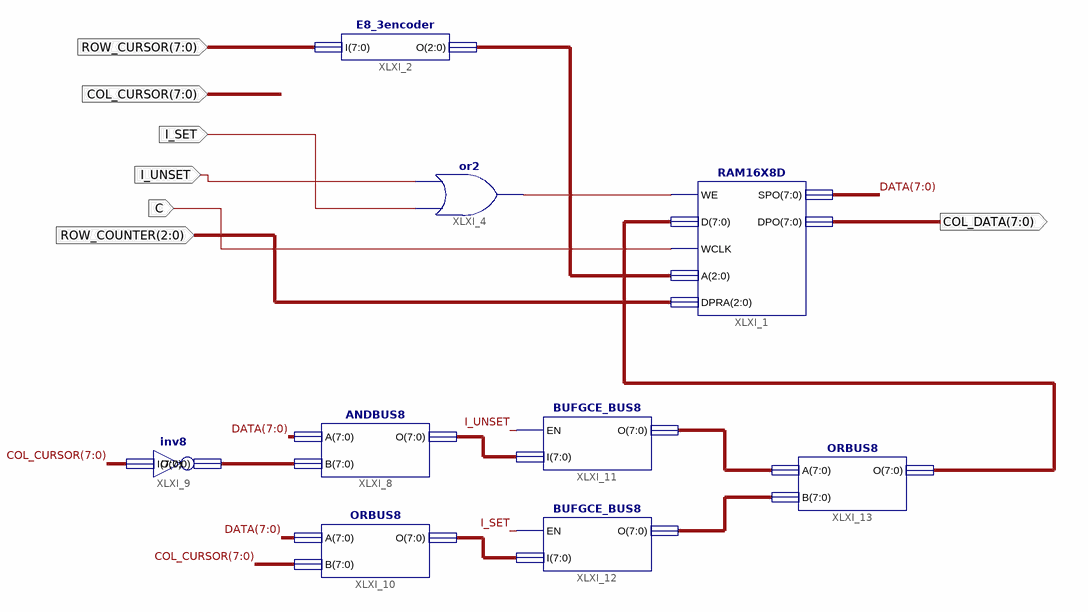
[diagram p0: schematic sheet 1]
// Xilinx ISE schematic StateUnit.sch (spartan6) as structural Verilog: 9 symbols, 7 ports
module StateUnit (
  input  [7:0] ROW_CURSOR,
  input  I_SET,
  input  I_UNSET,
  input  [2:0] ROW_COUNTER,
  input  C,
  input  [7:0] COL_CURSOR,
  output [7:0] COL_DATA
);

  wire XLXN_21;
  wire [2:0] XLXN_8;
  wire [7:0] DATA, XLXN_18, XLXN_24, XLXN_30, XLXN_31, XLXN_32, XLXN_33;

  RAM16X8D XLXI_1 (.A(XLXN_8), .D(XLXN_18), .DPO(COL_DATA), .DPRA(ROW_COUNTER), .SPO(DATA), .WCLK(C), .WE(XLXN_21));
  E8_3encoder XLXI_2 (.I(ROW_CURSOR), .O(XLXN_8));
  or XLXI_4 (XLXN_21, I_SET, I_UNSET);
  ANDBUS8 XLXI_8 (.A(DATA), .B(XLXN_24), .O(XLXN_32));
  inv8 XLXI_9 (.I(COL_CURSOR), .O(XLXN_24));
  ORBUS8 XLXI_10 (.A(DATA), .B(COL_CURSOR), .O(XLXN_33));
  BUFGCE_BUS8 XLXI_11 (.EN(I_UNSET), .I(XLXN_32), .O(XLXN_30));
  BUFGCE_BUS8 XLXI_12 (.EN(I_SET), .I(XLXN_33), .O(XLXN_31));
  ORBUS8 XLXI_13 (.A(XLXN_30), .B(XLXN_31), .O(XLXN_18));
endmodule
